# EAGLE schematic control-board (EAGLE 7.6.0)
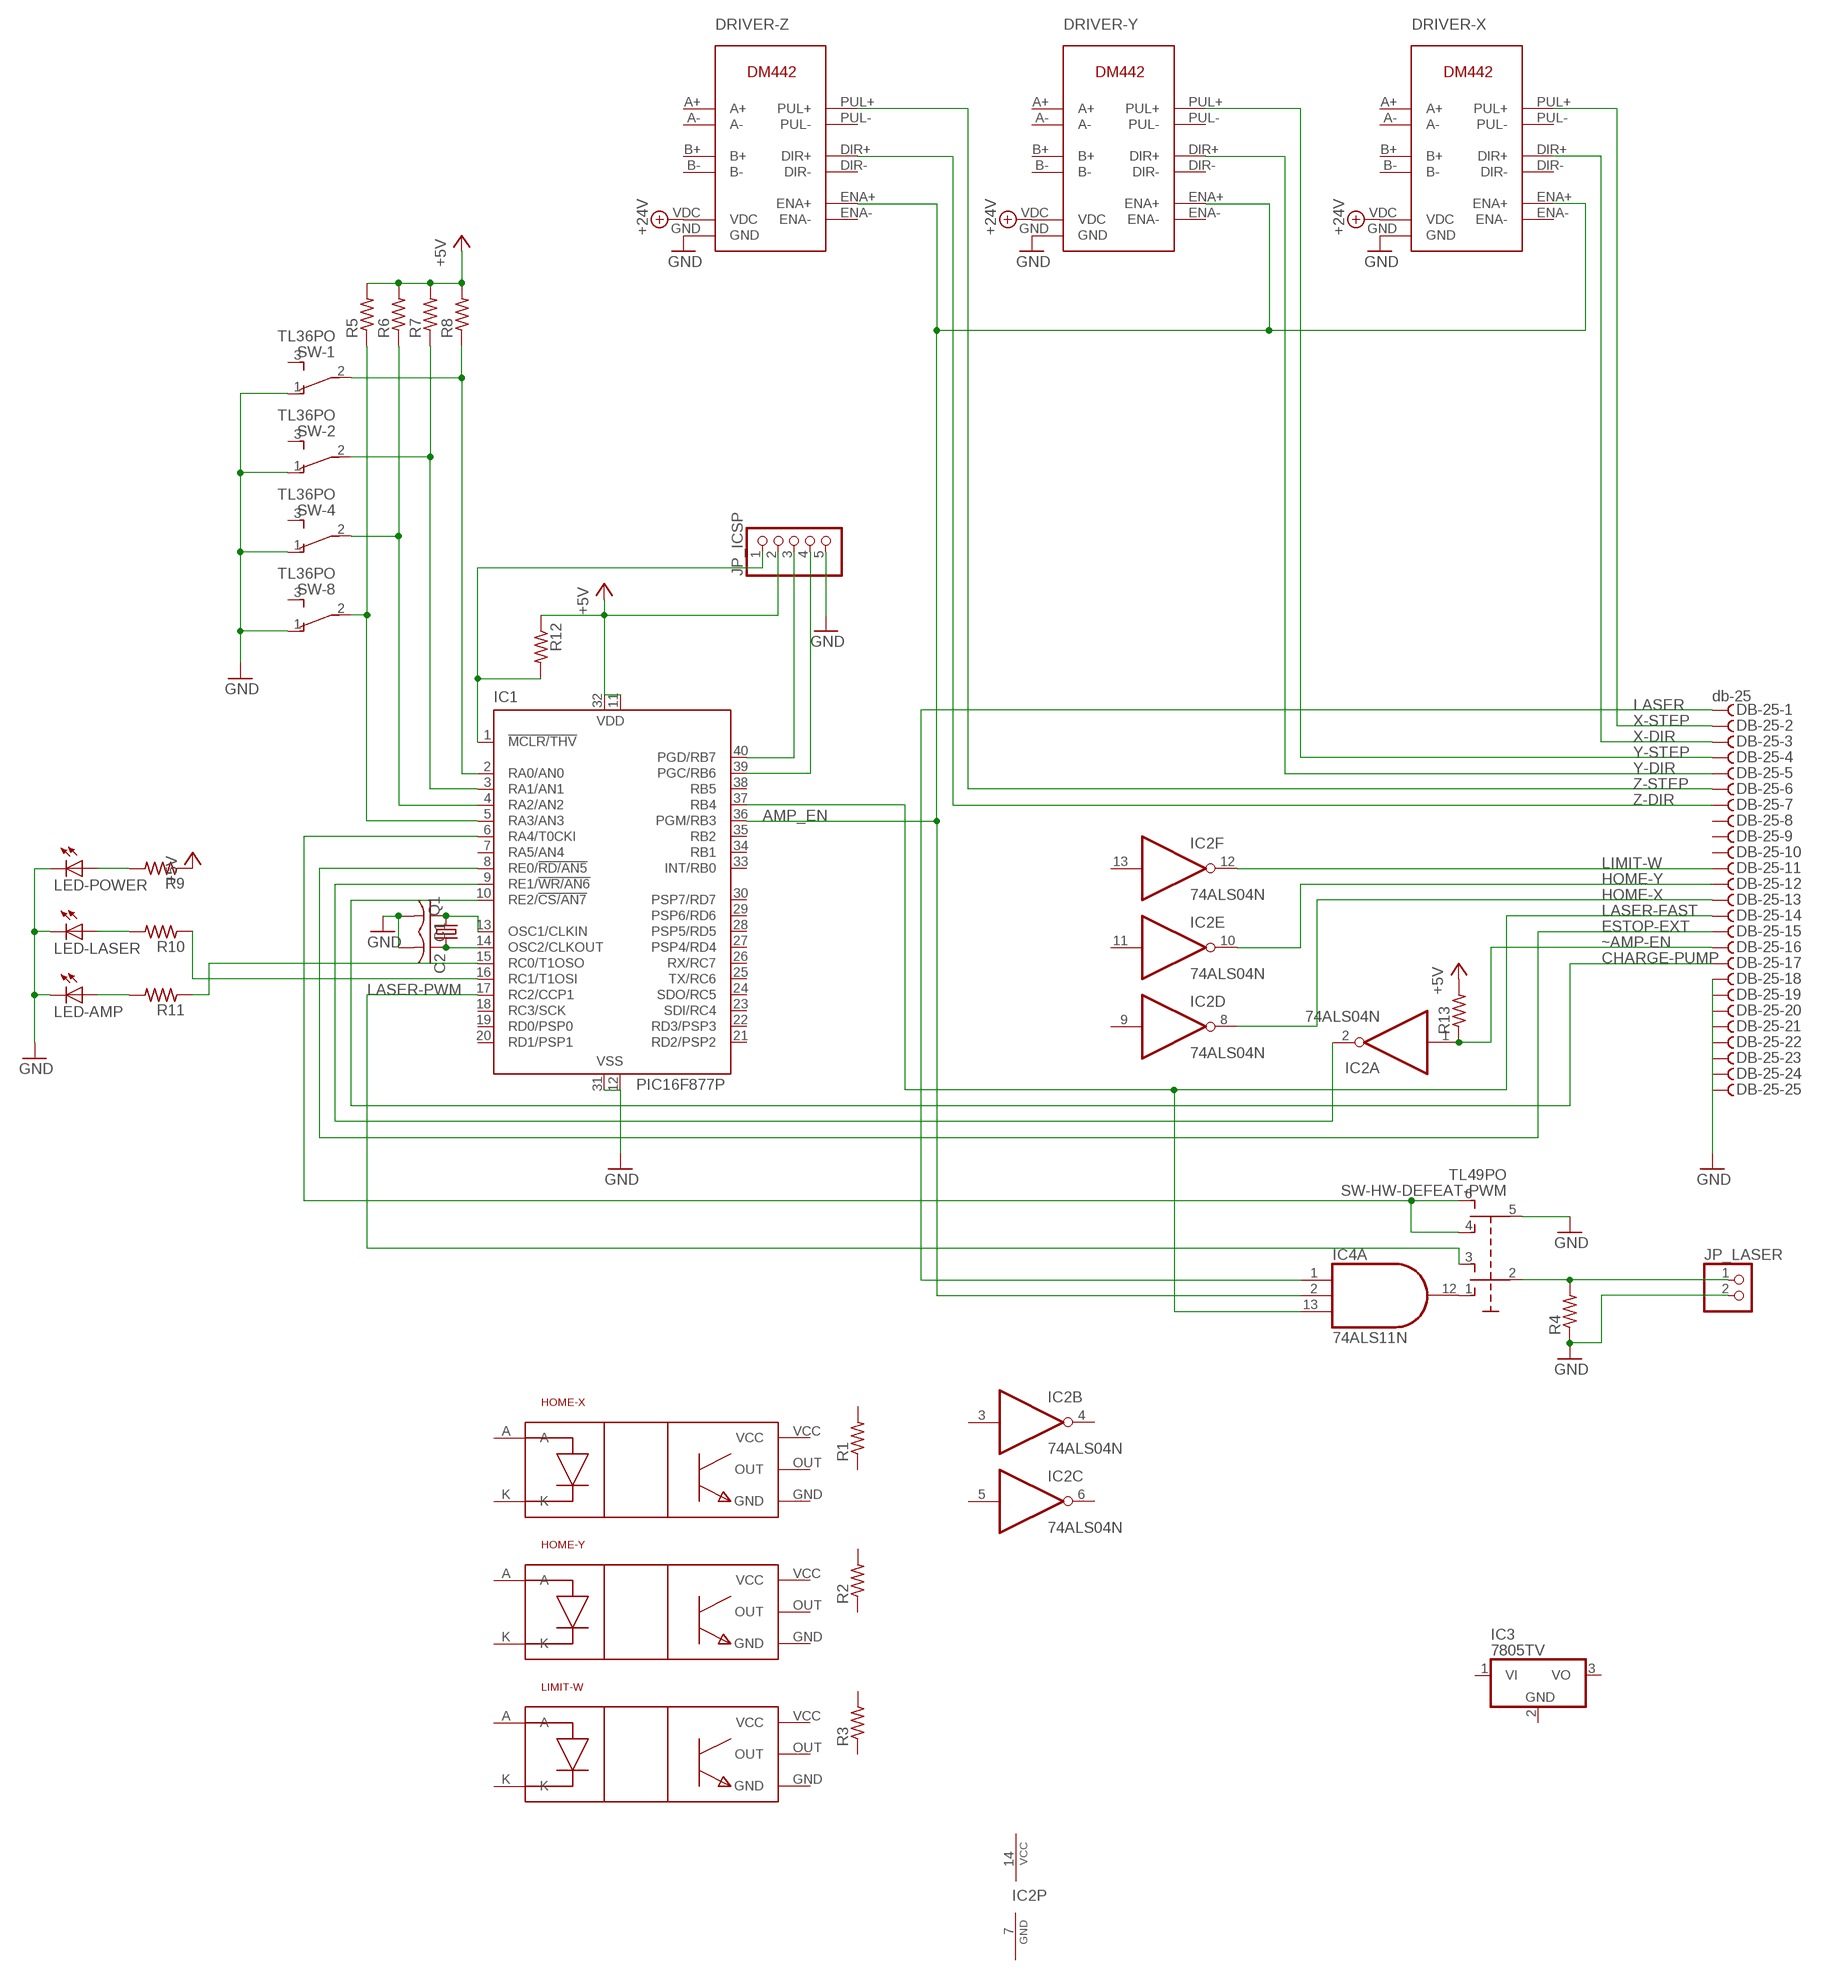
[diagram p0: schematic, sheet 1]

## Parts
C1  C-US025-025X050  [C025-025X050]
C2  C-US025-025X050  [C025-025X050]
DB-25  db-25  F25HS  [F25H]
DRIVER-X  STEPPER-DRIVER  [DM442]
DRIVER-Y  STEPPER-DRIVER  [DM442]
DRIVER-Z  STEPPER-DRIVER  [DM442]
HOME-X  PHOTOINTERRUPTER  [PHOTOINTERRUPTER]
HOME-Y  PHOTOINTERRUPTER  [PHOTOINTERRUPTER]
IC1  PIC16F877P  [DIL40]
IC2  74ALS04N  [DIL14]
IC3  7805TV  [TO220V]
IC4  74ALS11N  [DIL14]
JP_ICSP  PINHD-1X5  [1X05]
JP_LASER  PINHD-1X2  [1X02]
LED-AMP  LED5MM  [LED5MM]
LED-LASER  LED5MM  [LED5MM]
LED-POWER  LED5MM  [LED5MM]
LIMIT-W  PHOTOINTERRUPTER  [PHOTOINTERRUPTER]
Q1  CRYSTALHC33U-H  [HC33U-H]
R1  R-US_0204/7  [0204/7]
R2  R-US_0204/7  [0204/7]
R3  R-US_0204/7  [0204/7]
R4  R-US_0204/7  [0204/7]
R5  R-US_0204/7  [0204/7]
R6  R-US_0204/7  [0204/7]
R7  R-US_0204/7  [0204/7]
R8  R-US_0204/7  [0204/7]
R9  R-US_0204/7  [0204/7]
R10  R-US_0204/7  [0204/7]
R11  R-US_0204/7  [0204/7]
R12  R-US_0204/7  [0204/7]
R13  R-US_0204/7  [0204/7]
SW-1  TL36PO  [TL3XPO]
SW-2  TL36PO  [TL3XPO]
SW-4  TL36PO  [TL3XPO]
SW-8  TL36PO  [TL3XPO]
SW-HW-DEFEAT-PWM  TL49PO  [TL4XPO]
U$1  STEPPER-DRIVER  [DM442]  (not placed on a sheet)

## Nets
+5V: IC1.11(VDD) IC1.32(VDD) JP_ICSP.2 R5.2 R6.2 R7.2 R8.2 R9.1 R12.1 R13.2
+24V: DRIVER-X.VDC DRIVER-Y.VDC DRIVER-Z.VDC
AMP_EN: DRIVER-X.ENA+ DRIVER-Y.ENA+ DRIVER-Z.ENA+ IC1.36(PGM/RB3) IC4.2(A:I1)
CHARGE-PUMP: DB-25.17 IC1.10(RE2/!CS/AN7)
ESTOP-EXT: DB-25.15 IC1.8(RE0/!RD/AN5)
GND: C1.2 C2.2 DRIVER-X.GND DRIVER-Y.GND DRIVER-Z.GND IC1.12(VSS) IC1.31(VSS) JP_ICSP.5 JP_LASER.2 LED-AMP.K(C) LED-LASER.K(C) LED-POWER.K(C) R4.1 SW-1.1(O) SW-2.1(O) SW-4.1(O) SW-8.1(O) SW-HW-DEFEAT-PWM.5(P1)
HOME-X: DB-25.13 IC2.8(D:O)
HOME-Y: DB-25.12 IC2.10(E:O)
LASER: DB-25.1 IC4.1(A:I0)
LASER-FAST: DB-25.14 IC1.37(RB4) IC4.13(A:I2)
LASER-PWM: IC1.17(RC2/CCP1) SW-HW-DEFEAT-PWM.3(S)
LIMIT-W: DB-25.11 IC2.12(F:O)
MCLR: IC1.1(!MCLR/THV) JP_ICSP.1 R12.2
N$1: JP_LASER.1 R4.2 SW-HW-DEFEAT-PWM.2(P)
N$2: IC1.6(RA4/T0CKI) SW-HW-DEFEAT-PWM.4(O1) SW-HW-DEFEAT-PWM.6(S1)
N$3: DB-25.18 DB-25.19 DB-25.20 DB-25.21 DB-25.22 DB-25.23 DB-25.24 DB-25.25
N$4: IC4.12(A:O) SW-HW-DEFEAT-PWM.1(O)
N$5: IC1.5(RA3/AN3) R5.1 SW-8.2(P)
N$6: IC1.4(RA2/AN2) R6.1 SW-4.2(P)
N$7: IC1.3(RA1/AN1) R7.1 SW-2.2(P)
N$8: IC1.2(RA0/AN0) R8.1 SW-1.2(P)
N$9: LED-POWER.A R9.2
N$10: LED-LASER.A R10.2
N$11: LED-AMP.A R11.2
N$12: IC1.16(RC1/T1OSI) R10.1
N$13: IC1.15(RC0/T1OSO) R11.1
N$14: C2.1 IC1.14(OSC2/CLKOUT) Q1.1
N$15: C1.1 IC1.13(OSC1/CLKIN) Q1.2
N$18: IC1.40(PGD/RB7) JP_ICSP.3
N$19: IC1.39(PGC/RB6) JP_ICSP.4
X-DIR: DB-25.3 DRIVER-X.DIR+
X-ENABLE: IC1.9(RE1/!WR/AN6) IC2.2(A:O)
X-STEP: DB-25.2 DRIVER-X.PUL+
Y-DIR: DB-25.5 DRIVER-Y.DIR+
Y-STEP: DB-25.4 DRIVER-Y.PUL+
Z-DIR: DB-25.7 DRIVER-Z.DIR+
Z-STEP: DB-25.6 DRIVER-Z.PUL+
~AMP-EN: DB-25.16 IC2.1(A:I) R13.1
Unconnected: DB-25.8 DB-25.9 DB-25.10 DRIVER-X.A+ DRIVER-X.A- DRIVER-X.B+ DRIVER-X.B- DRIVER-X.DIR- DRIVER-X.ENA- DRIVER-X.PUL- DRIVER-Y.A+ DRIVER-Y.A- DRIVER-Y.B+ DRIVER-Y.B- DRIVER-Y.DIR- DRIVER-Y.ENA- DRIVER-Y.PUL- DRIVER-Z.A+ DRIVER-Z.A- DRIVER-Z.B+ DRIVER-Z.B- DRIVER-Z.DIR- DRIVER-Z.ENA- DRIVER-Z.PUL- HOME-X.OUT HOME-Y.OUT IC1.7(RA5/AN4) IC1.18(RC3/SCK) IC1.19(RD0/PSP0) IC1.20(RD1/PSP1) IC1.21(RD2/PSP2) IC1.22(RD3/PSP3) IC1.23(SDI/RC4) IC1.24(SDO/RC5) IC1.25(TX/RC6) IC1.26(RX/RC7) IC1.27(PSP4/RD4) IC1.28(PSP5/RD5) IC1.29(PSP6/RD6) IC1.30(PSP7/RD7) IC1.33(INT/RB0) IC1.34(RB1) IC1.35(RB2) IC1.38(RB5) IC2.3(B:I) IC2.4(B:O) IC2.5(C:I) IC2.6(C:O) IC2.9(D:I) IC2.11(E:I) IC2.13(F:I) IC3.1(VI) IC3.2(GND) IC3.3(VO) IC4.3(B:I0) IC4.4(B:I1) IC4.5(B:I2) IC4.6(B:O) IC4.8(C:O) IC4.9(C:I0) IC4.10(C:I1) IC4.11(C:I2) LIMIT-W.OUT R1.1 R1.2 R2.1 R2.2 R3.1 R3.2 SW-1.3(S) SW-2.3(S) SW-4.3(S) SW-8.3(S) U$1.A+ U$1.A- U$1.B+ U$1.B- U$1.DIR+ U$1.DIR- U$1.ENA+ U$1.ENA- U$1.PUL+ U$1.PUL-

## Power pins joined to a net without a drawn wire
A: HOME-X.A HOME-Y.A LIMIT-W.A
GND: HOME-X.GND HOME-Y.GND IC2.7(P:GND) IC4.7(P:GND) LIMIT-W.GND U$1.GND
K: HOME-X.K HOME-Y.K LIMIT-W.K
VCC: HOME-X.VCC HOME-Y.VCC IC2.14(P:VCC) IC4.14(P:VCC) LIMIT-W.VCC
VDC: U$1.VDC

## Library data of the parts
C1 C2 = rcl:C-US: CAPACITOR, American symbol
DB-25 = con-subd:F25?S: SUB-D; OC_FARNELL: unknown; OC_NEWARK: unknown
DRIVER-X DRIVER-Y DRIVER-Z U$1 = stepper-driver:STEPPER-DRIVER
HOME-X HOME-Y LIMIT-W = stepper-driver:PHOTOINTERRUPTER
IC1 = microchip:PIC16F87*: MICROCONTROLLER; MF: MICROCHIP; MPN: PIC16F877-04/P; OC_FARNELL: 9761349; OC_NEWARK: 61K3463
IC2 = 74xx-us:74*04: Hex INVERTER
IC3 = linear:78*: Positive VOLTAGE REGULATOR Source: http://cache.national.com/ds/LM/LM78L05.pdf http://www.fairchildsemi.com/ds/LM/LM7805.pdf
IC4 = 74xx-us:74*11: Triple 3-input AND gate
JP_ICSP = pinhead:PINHD-1X5: PIN HEADER
JP_LASER = pinhead:PINHD-1X2: PIN HEADER
LED-AMP LED-LASER LED-POWER = led:LED: LED OSRAM: - CHIPLED LG R971, LG N971, LY N971, LG Q971, LY Q971, LO R971, LY R971 LH N974, LH R974 LS Q976, LO Q976, LY Q976 LO Q996 - Hyper CHIPLED LW Q18S LB Q993, LB Q99A, LB R99A - SideLED LS A670, LO A670, LY A670, LG A670, LP A670 LB A673, LV A673, LT A673, LW A673 LH A674 LY A675 LS A676, LA A676, LO A676, LY A676, LW A676 LS A679, LY A679, LG A679 - Hyper Micro SIDELED® LS Y876, LA Y876, LO Y876, LY Y876 LT Y87S - SmartLED LW L88C, LW L88S LB L89C, LB L89S, LG L890 LS L89K, LO L89K, LY L89K LS L896, LA L896, LO L896, LY L896 - TOPLED LS T670, LO T670, LY T670, LG T670, LP T670 LSG T670, LSP T670, LSY T670, LOP T670, LYG T670 LG T671, LOG T671, LSG T671 LB T673, LV T673, LT T673, LW T673 LH T674 LS T676, LA T676, LO T676, LY T676, LB T676, LH T676, LSB T676, LW T676 LB T67C, LV T67C, LT T67C, LS T67K, LO T67K, LY T67K, LW E67C LS E67B, LA E67B, LO E67B, LY E67B, LB E67C, LV E67C, LT E67C LW T67C LS T679, LY T679, LG T679 LS T770, LO T770, LY T770, LG T770, LP T770 LB T773, LV T773, LT T773, LW T773 LH T774 LS E675, LA E675, LY E675, LS T675 LS T776, LA T776, LO T776, LY T776, LB T776 LHGB T686 LT T68C, LB T68C - Hyper Mini TOPLED® LB M676 - Mini TOPLED Santana® LG M470 LS M47K, LO M47K, LY M47K Source: http://www.osram.convergy.de LUXEON: - LUMILED® LXK2-PW12-R00, LXK2-PW12-S00, LXK2-PW14-U00, LXK2-PW14-V00 LXK2-PM12-R00, LXK2-PM12-S00, LXK2-PM14-U00 LXK2-PE12-Q00, LXK2-PE12-R00, LXK2-PE12-S00, LXK2-PE14-T00, LXK2-PE14-U00 LXK2-PB12-K00, LXK2-PB12-L00, LXK2-PB12-M00, LXK2-PB14-N00, LXK2-PB14-P00, LXK2-PB14-Q00 LXK2-PR12-L00, LXK2-PR12-M00, LXK2-PR14-Q00, LXK2-PR14-R00 LXK2-PD12-Q00, LXK2-PD12-R00, LXK2-PD12-S00 LXK2-PH12-R00, LXK2-PH12-S00 LXK2-PL12-P00, LXK2-PL12-Q00, LXK2-PL12-R00 Source: www.luxeon.com KINGBRIGHT: KA-3528ASYC Source: www.kingbright.com
Q1 = crystal:CRYSTAL: CRYSTAL; OC_FARNELL: unknown; OC_NEWARK: unknown
R1-R13 = rcl:R-US_: RESISTOR, American symbol
SW-1 SW-2 SW-4 SW-8 = switch:TL36PO: TINY SWITCH ON - ON Source: http://www2.produktinfo.conrad.com/datenblaetter/700000-724999/705152-da-01-de-Subminiaturschalter_TL_36YO.pdf
SW-HW-DEFEAT-PWM = switch:TL49PO: TINY SWITCH ON OFF ON Source: http://www2.produktinfo.conrad.com/datenblaetter/700000-724999/705152-da-01-de-Subminiaturschalter_TL_36YO.pdf